# EAGLE design SUSTAINA-PMX-Control-Board (EAGLE 9.6.2)
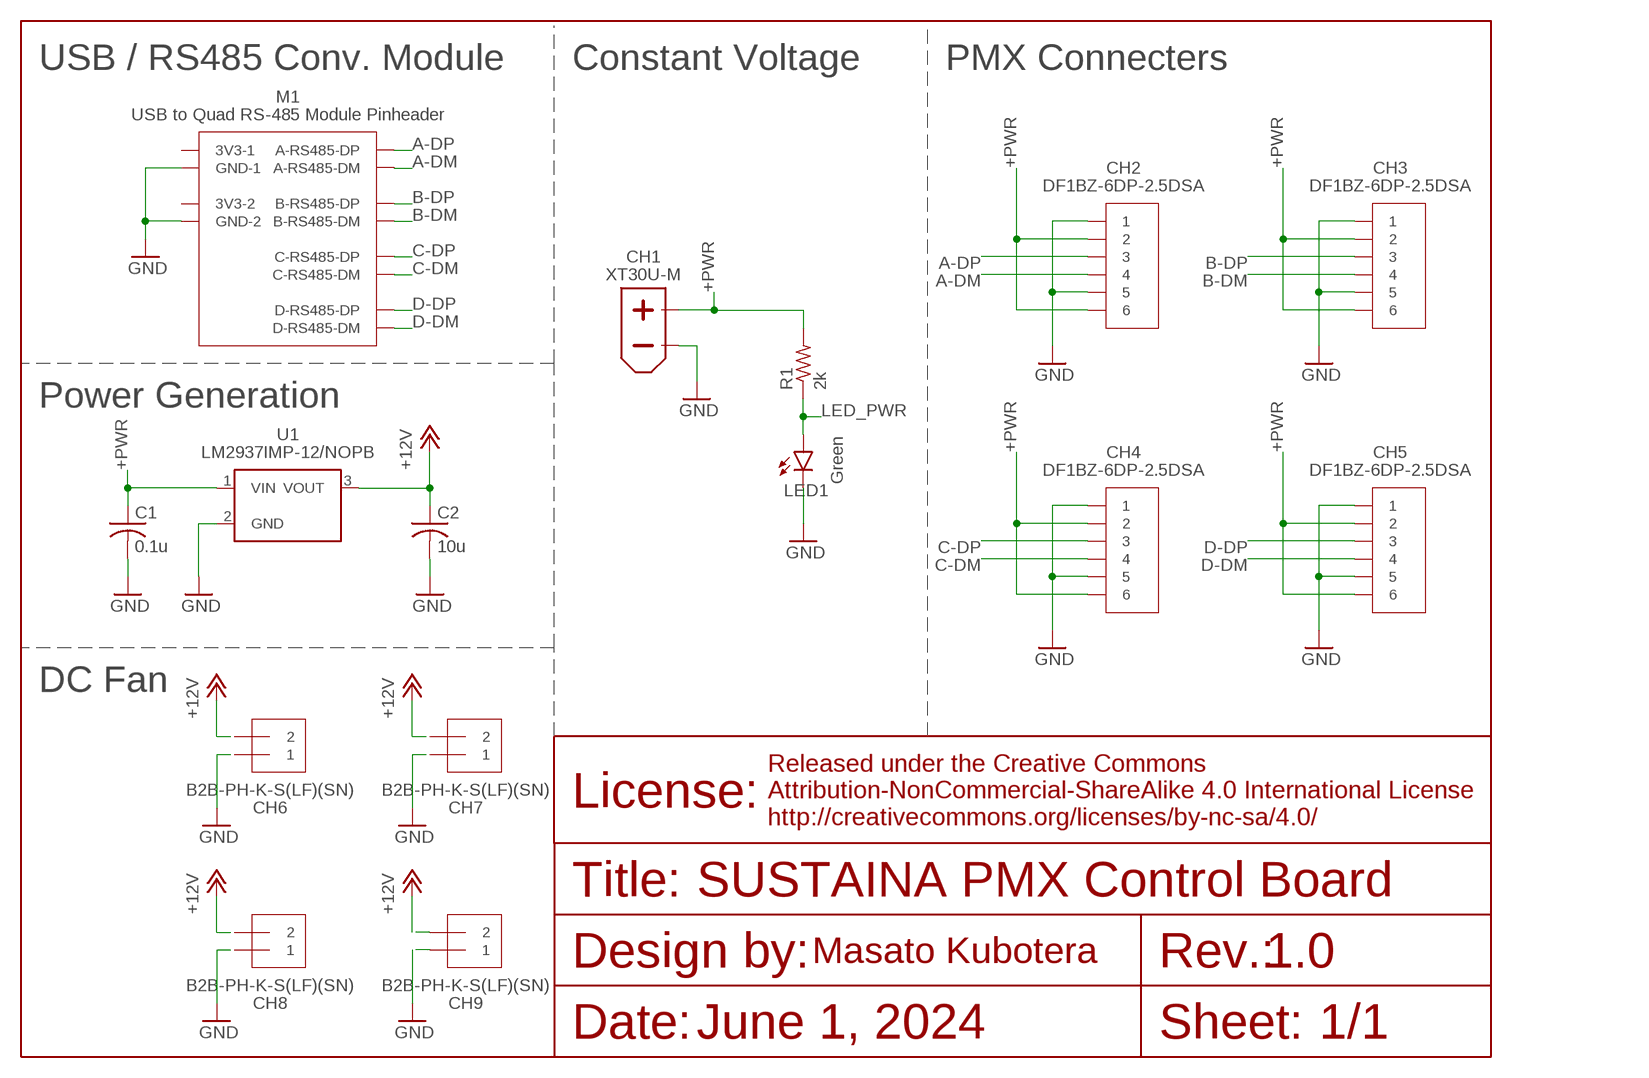
[diagram p0: schematic, sheet 1]

## Parts
C1  0.1u  C-USC0603  [C0603]
C2  10u  C-USC0603  [C0603]
CH1  XT30U-M  [XT30U-M]
CH2  DF1BZ-6DP-25DSA  [DF1BZ-6DP-25DSA]
CH3  DF1BZ-6DP-25DSA  [DF1BZ-6DP-25DSA]
CH4  DF1BZ-6DP-25DSA  [DF1BZ-6DP-25DSA]
CH5  DF1BZ-6DP-25DSA  [DF1BZ-6DP-25DSA]
CH6  B2B-PH-K-S(LF)(SN)  [B2B-PH-K-S(LF)(SN)]
CH7  B2B-PH-K-S(LF)(SN)  [B2B-PH-K-S(LF)(SN)]
CH8  B2B-PH-K-S(LF)(SN)  [B2B-PH-K-S(LF)(SN)]
CH9  B2B-PH-K-S(LF)(SN)  [B2B-PH-K-S(LF)(SN)]
LED1  Green  LEDSML0603  [SML0603]
M1  USB-TO-QUAD-RS-485-CONV-MODULESINGLE  [USB-TO-QUAD-RS-485-CONV-MODULE-TPLACE-SINGLE]
R1  2k  R-US_R0603  [R0603]
U1  LM2937IMP-12NOPB  [SOT-223]

## Nets
+12V [power]: C2.1 CH6.2 CH7.2 CH8.2 CH9.2 U1.3(VOUT)
+PWR [power]: C1.1 CH1.+ CH2.2 CH2.6 CH3.2 CH3.6 CH4.2 CH4.6 CH5.2 CH5.6 R1.2 U1.1(VIN)
A-DM [signal]: CH2.4 M1.A-RS-485-DM1(A-RS485-DM)
A-DP [signal]: CH2.3 M1.A-RS-485-DP1(A-RS485-DP)
B-DM [signal]: CH3.4 M1.B-RS-485-DM1(B-RS485-DM)
B-DP [signal]: CH3.3 M1.B-RS-485-DP1(B-RS485-DP)
C-DM [signal]: CH4.4 M1.C-RS-485-DM1(C-RS485-DM)
C-DP [signal]: CH4.3 M1.C-RS-485-DP1(C-RS485-DP)
D-DM [signal]: CH5.4 M1.D-RS-485-DM1(D-RS485-DM)
D-DP [signal]: CH5.3 M1.D-RS-485-DP1(D-RS485-DP)
GND [power]: C1.2 C2.2 CH1.- CH2.1 CH2.5 CH3.1 CH3.5 CH4.1 CH4.5 CH5.1 CH5.5 CH6.1 CH7.1 CH8.1 CH9.1 LED1.C M1.GND-1 M1.GND-2 U1.2(GND)
LED_PWR [low-power]: LED1.A R1.1
Unconnected: M1.3V3-1 M1.3V3-2

## Notes on the sheet
- USB / RS485 Conv. Module | Constant Voltage | PMX Connecters
- Power Generation
- DC Fan
- SUSTAINA PMX Control Board
- 1.0
- June 1, 2024 | 1/1

## Library data of the parts
C1 C2 = rcl:C-US: CAPACITOR, American symbol; SPICEPREFIX: C
CH1 = XT30:XT30U-M
CH2-CH5 = DF1BZ-6DP-2.5DSA:DF1BZ-6DP-25DSA
CH6-CH9 = JST-PH:B2B-PH-K-S(LF)(SN)
LED1 = led:LED: LED OSRAM: - CHIPLED LG R971, LG N971, LY N971, LG Q971, LY Q971, LO R971, LY R971 LH N974, LH R974 LS Q976, LO Q976, LY Q976 LO Q996 - Hyper CHIPLED LW Q18S LB Q993, LB Q99A, LB R99A - SideLED LS A670, LO A670, LY A670, LG A670, LP A670 LB A673, LV A673, LT A673, LW A673 LH A674 LY A675 LS A676, LA A676, LO A676, LY A676, LW A676 LS A679, LY A679, LG A679 - Hyper Micro SIDELED® LS Y876, LA Y876, LO Y876, LY Y876 LT Y87S - SmartLED LW L88C, LW L88S LB L89C, LB L89S, LG L890 LS L89K, LO L89K, LY L89K LS L896, LA L896, LO L896, LY L896 - TOPLED LS T670, LO T670, LY T670, LG T670, LP T670 LSG T670, LSP T670, LSY T670, LOP T670, LYG T670 LG T671, LOG T671, LSG T671 LB T673, LV T673, LT T673, LW T673 LH T674 LS T676, LA T676, LO T676, LY T676, LB T676, LH T676, LSB T676, LW T676 LB T67C, LV T67C, LT T67C, LS T67K, LO T67K, LY T67K, LW E67C LS E67B, LA E67B, LO E67B, LY E67B, LB E67C, LV E67C, LT E67C LW T67C LS T679, LY T679, LG T679 LS T770, LO T770, LY T770, LG T770, LP T770 LB T773, LV T773, LT T773, LW T773 LH T774 LS E675, LA E675, LY E675, LS T675 LS T776, LA T776, LO T776, LY T776, LB T776 LHGB T686 LT T68C, LB T68C - Hyper Mini TOPLED® LB M676 - Mini TOPLED Santana® LG M470 LS M47K, LO M47K, LY M47K Source: http://www.osram.convergy.de LUXEON: - LUMILED® LXK2-PW12-R00, LXK2-PW12-S00, LXK2-PW14-U00, LXK2-PW14-V00 LXK2-PM12-R00, LXK2-PM12-S00, LXK2-PM14-U00 LXK2-PE12-Q00, LXK2-PE12-R00, LXK2-PE12-S00, LXK2-PE14-T00, LXK2-PE14-U00 LXK2-PB12-K00, LXK2-PB12-L00, LXK2-PB12-M00, LXK2-PB14-N00, LXK2-PB14-P00, LXK2-PB14-Q00 LXK2-PR12-L00, LXK2-PR12-M00, LXK2-PR14-Q00, LXK2-PR14-R00 LXK2-PD12-Q00, LXK2-PD12-R00, LXK2-PD12-S00 LXK2-PH12-R00, LXK2-PH12-S00 LXK2-PL12-P00, LXK2-PL12-Q00, LXK2-PL12-R00 Source: www.luxeon.com KINGBRIGHT: KA-3528ASYC Source: www.kingbright.com
M1 = USB-to-Quad-RS-485-Conv-Module:USB-TO-QUAD-RS-485-CONV-MODULE
R1 = rcl:R-US_: RESISTOR, American symbol; SPICEPREFIX: R
U1 = LM2937IMP-12NOPB:LM2937IMP-12NOPB

## Net classes
0 default: width 0.254 mm, clearance 0.127 mm
1 signal: width 0.203 mm, clearance 0.127 mm
2 power: width 0.508 mm, clearance 0.127 mm
3 low-power: width 0.254 mm

## Board
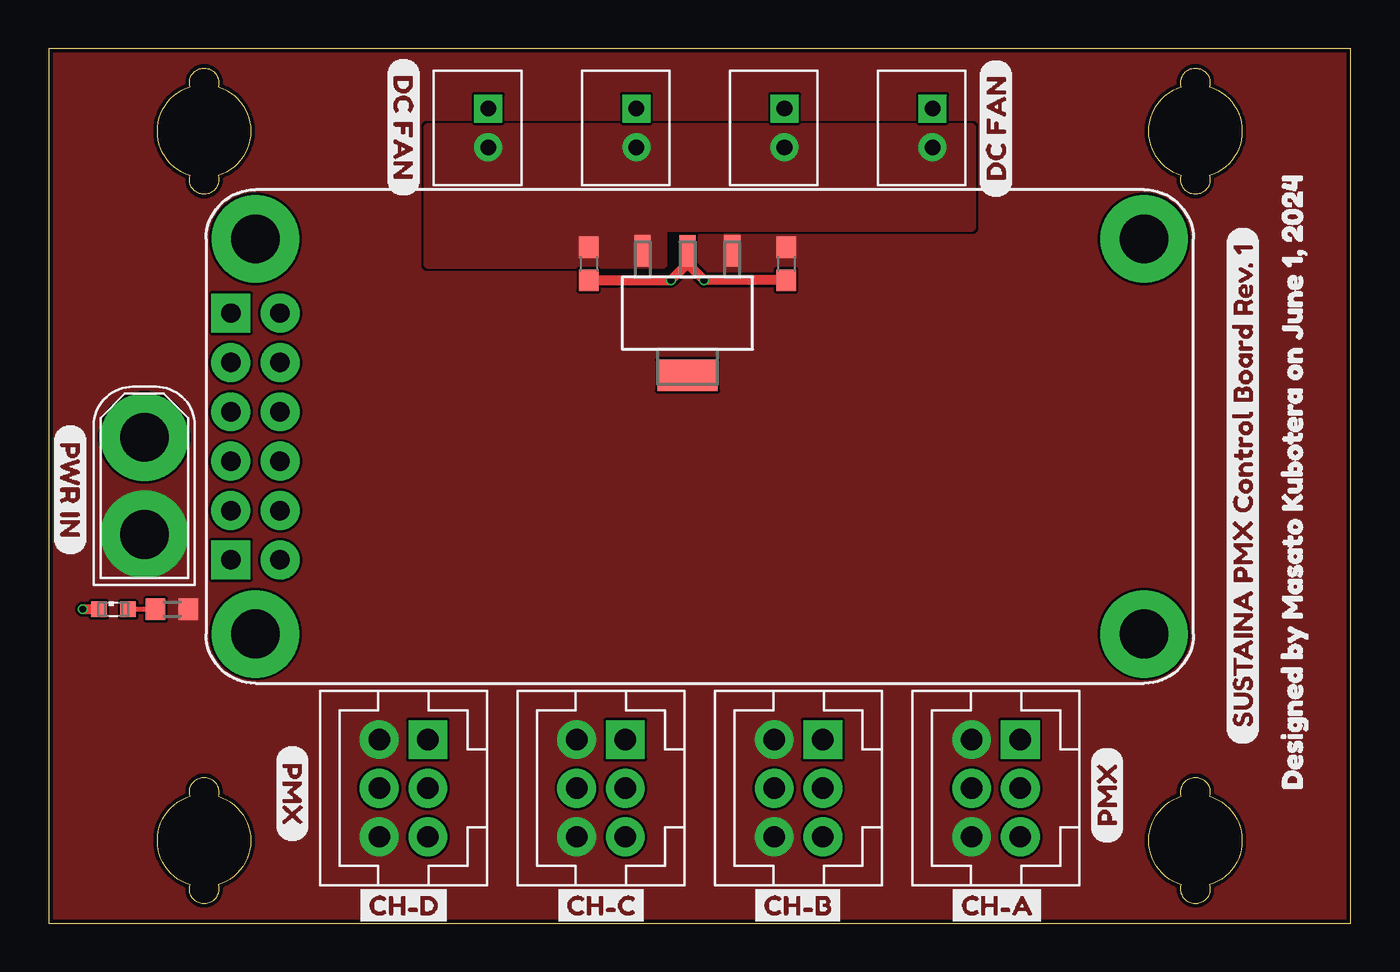
[diagram p1: board, top side]
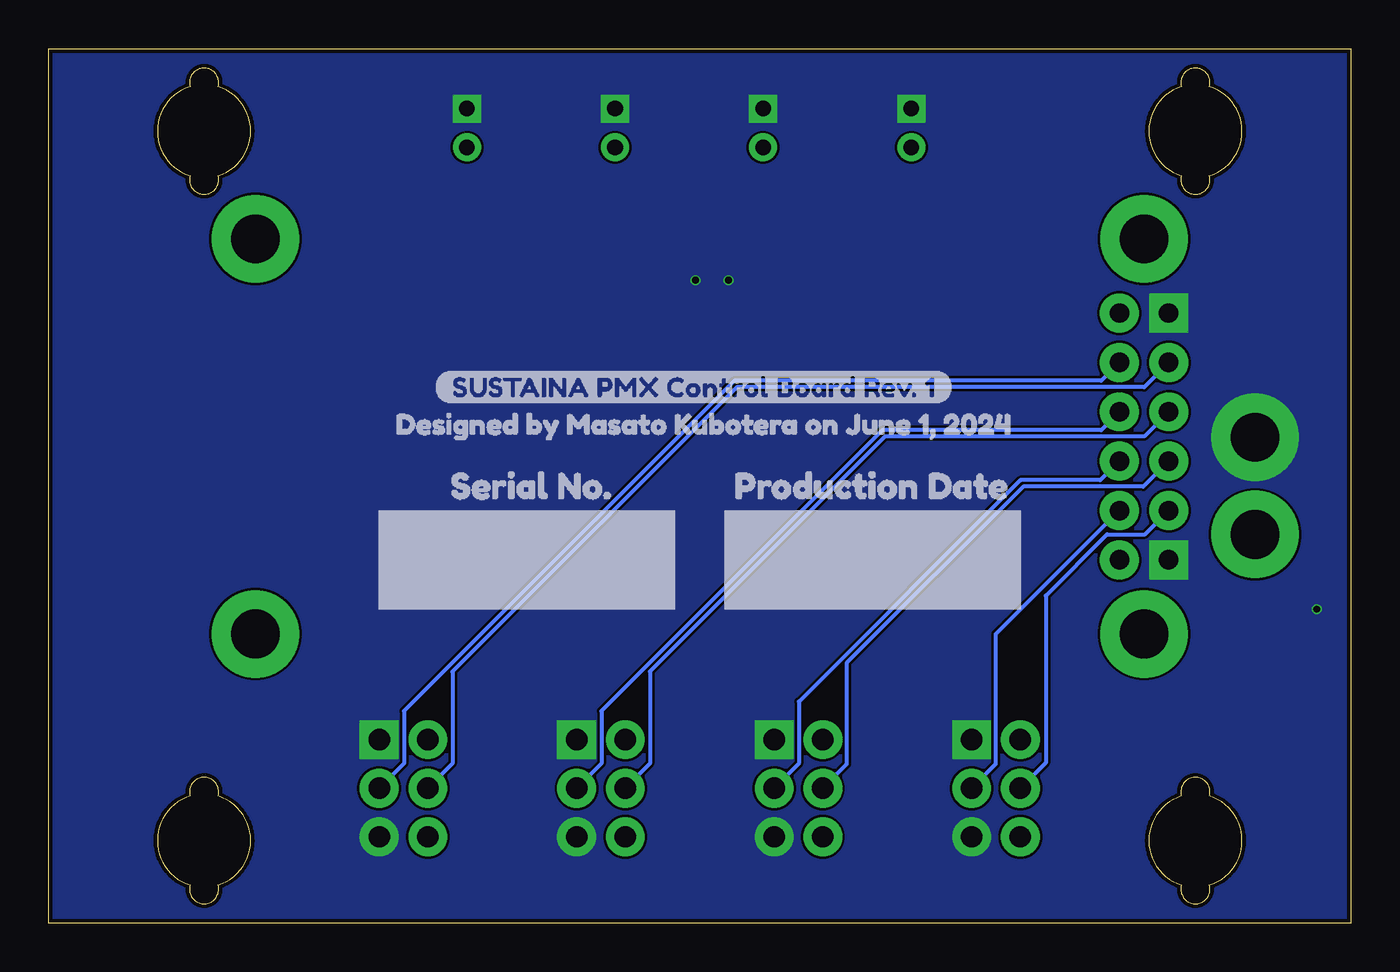
[diagram p2: board, bottom side, seen from below]

Size 67 x 45 mm. Coordinates in mm from the lower left corner, seen from the top.
Outline: 67,45 0,45 0,0 67,0 67,45
Outline: 8.72,1.96 arc-213 7.28,1.96 arc-145 7.28,6.54 arc-213 8.72,6.54 arc-145 8.72,1.96
Outline: 59.72,1.96 arc-213 58.28,1.96 arc-145 58.28,6.54 arc-213 59.72,6.54 arc-145 59.72,1.96
Outline: 58.28,43.04 arc-213 59.72,43.04 arc-145 59.72,38.46 arc-213 58.28,38.46 arc-145 58.28,43.04
Outline: 7.28,43.04 arc-213 8.72,43.04 arc-145 8.72,38.46 arc-213 7.28,38.46 arc-145 7.28,43.04
Copper layers (1*16): Top 0.035mm / dielectric 1.6mm / Bottom 0.035mm
Design rules "jlcpcb-2layers": minimum track width 5mil, minimum drill 0.3mm, track to track 5mil, track to pad 5mil, pad to pad 5mil, via to via 5mil, smd to smd 5mil, copper to edge 0.2mm, drill to drill 6mil, minimum pad ring 10mil, minimum via ring 3mil, stop-mask expansion 4mil, vias tented up to drill 0mil, thermal gap 10mil

### Footprints (pad centres in the part's own frame; a part is rotated, then mirrored left to right if it is on the bottom)
C0603 = smd 1.1 x 1: 1 -0.85,0; 2 0.85,0
XT30U-M = drill 2.5 pad 4.5: + 2.5,0; - -2.5,0
DF1BZ-6DP-25DSA = drill 1.1 pad 2 square: 1 -2.5,1.25 | drill 1.1 pad 2: 2 -2.5,-1.25; 3 0,1.25; 4 0,-1.25; 5 2.5,1.25; 6 2.5,-1.25
B2B-PH-K-S(LF)(SN) = drill 0.8 square: 1 -1,0.55 | drill 0.8: 2 1,0.55
SML0603 = smd 0.8 x 0.8: A 0.75,0; C -0.75,0
USB-TO-QUAD-RS-485-CONV-MODULE-TPLACE-SINGLE = drill 1 pad 2: 3V3-1 3.81,6.35; 3V3-2 3.81,-6.35; A-RS-485-DM1 1.27,3.81; A-RS-485-DP1 3.81,3.81; B-RS-485-DM1 1.27,1.27; B-RS-485-DP1 3.81,1.27; C-RS-485-DM1 1.27,-1.27; C-RS-485-DP1 3.81,-1.27; D-RS-485-DM1 1.27,-3.81; D-RS-485-DP1 3.81,-3.81 | drill 1 pad 2 square: GND-1 1.27,6.35; GND-2 1.27,-6.35 | drill 2.5 pad 4.5: H1 2.54,10.16; H2 2.54,-10.16; H3 48.26,10.16; H4 48.26,-10.16
R0603 = smd 1 x 1.1: 1 -0.85,0; 2 0.85,0
SOT-223 = smd 1.6 x 0.838: 1 -3.2,2.311; 2 -3.2,0; 3 -3.2,-2.311 | smd 1.6 x 3.099: 4 3.2,0

### Placement (x,y rotation side)
C1  37.95,33.93 270 top
C2  27.79,33.93 270 top
CH1  4.93,22.5 270 top
CH2  48.74,6.94 270 top
CH3  38.58,6.94 270 top
CH4  28.42,6.94 270 top
CH5  18.26,6.94 270 top
CH6  22.07,40.91 270 top
CH7  29.69,40.91 270 top
CH8  37.31,40.91 270 top
CH9  44.93,40.91 270 top
LED1  3.34,16.15 0 top
M1  8.1,25.04 0 top
R1  6.35,16.15 0 top
U1  32.87,31.39 270 top
U$1  DESIGNED_BY_MASATO_KUBOTERA_ON_FEBRUARY_190DESIGNED_BY_MASATO_KUBOTERA_ON_FEBRUARY_190  [DESIGNED_BY_MASATO_KUBOTERA_ON_JUNE_1]  63.98,5.99 90 top
U$2  DESIGNED_BY_MASATO_KUBOTERA_ON_FEBRUARY_190DESIGNED_BY_MASATO_KUBOTERA_ON_FEBRUARY_190  [DESIGNED_BY_MASATO_KUBOTERA_ON_JUNE_1]  50.01,25.68 0 bottom
U$3  PRODUCTION_DATE0  [PRODUCTION_DATE0]  32.87,22.5 0 bottom
U$4  SERIAL_NO#0  [SERIAL_NO#0]  47.47,22.5 0 bottom
U$5  [PMX]  12.55,9.16 270 top
U$6  [PMX]  54.45,4.09 90 top
U$7  [DC_FAN]  48.74,37.26 90 top
U$8  [CH#A1]  46.04,0.91 0 top
U$9  [CH#B1]  35.88,0.91 0 top
U$10  [CH#C1]  25.72,0.91 0 top
U$11  [CH#D1]  15.56,0.91 0 top
U$12  [SUSTAINA_PMX_CONTROL_BOARD_REV#_1]  61.44,9.16 90 top
U$13  [SUSTAINA_PMX_CONTROL_BOARD_REV#_1]  47.15,27.58 0 bottom
U$16  [PWR_IN0]  1.12,25.68 270 top
U$19  [DC_FAN]  18.26,44.57 270 top

### Tracks (layer width: path | path; a pad name or v marks a point on that pad's centre or on a via)
+12V
  pour Top (no thermals): 19.53,40.91 19.53,33.93 31.59,33.93 31.59,35.84 47.47,35.84 47.47,40.91
+PWR
  pour Top (rank 6, no thermals): -2.06,47.9 -2.06,-2.9 69.06,-2.9 69.06,47.9
A-DM
  Bottom 0.203: CH2.4 46.22,8.21 46.22,12.94 31.58,27.58 10.64,27.58 M1.A-RS-485-DM1
A-DP
  Bottom 0.203: CH2.3 48.72,8.21 48.72,10.91 31.72,27.91 12.85,27.91 M1.A-RS-485-DP1
B-DM
  Bottom 0.203: M1.B-RS-485-DM1 10.64,25.04 23.96,25.04 36.06,12.94 36.06,8.21 CH3.4
B-DP
  Bottom 0.203: CH3.3 38.56,8.21 38.56,10.91 24.1,25.37 12.85,25.37 M1.B-RS-485-DP1
C-DM
  Bottom 0.203: M1.C-RS-485-DM1 10.68,22.46 16.86,22.46 25.94,13.38 25.94,8.17 CH4.4
C-DP
  Bottom 0.203: CH4.3 28.4,8.21 28.4,11.39 17,22.79 12.89,22.79 M1.C-RS-485-DP1
D-DM
  Bottom 0.203: CH5.4 15.7,8.25 15.7,16.85 12.55,20 10.6,20 M1.D-RS-485-DM1
D-DP
  Bottom 0.203: CH5.3 18.28,8.17 18.28,14.86 M1.D-RS-485-DP1
GND  (via drill 0.35)
  Top 0.508: LED1.C v1.75,16.15 | C2.2 v32.02,33.08 32.87,33.93 | U1.2 32.87,33.93 | C1.2 v33.72,33.08 32.87,33.93
  pour Bottom (no thermals): -4.6,50.44 -4.6,-5.44 -2.06,-5.44 71.6,-5.44 71.6,50.44
LED_PWR
  Top 0.254: R1.1 LED1.A